# Altium schematic sheet Current Regulator.SchDoc
size Letter
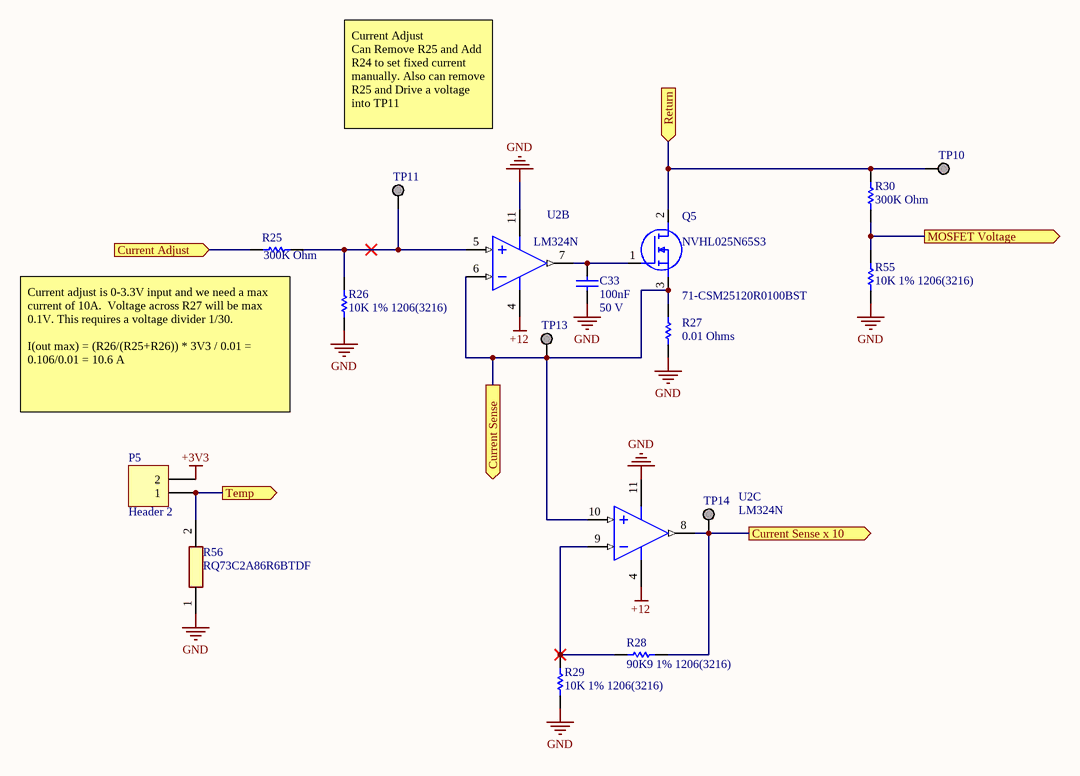
[diagram p0: Current Regulator.SchDoc]

## Parts
C33  value 100nF  Rated Voltage: 50 V  [CAPC1206(3216)100_N]  (hidden comment: CAP 100nF 50V 1206(3216))
P5  Header 2  [HDR1X2]
Q5  NVHL025N65S3  [TO556P482X1562X2475-3P]
R25  value 300K Ohm  [RESC1206(3216)_L]  (hidden comment: 300K 1% 1206(3216))
R26  10K 1% 1206(3216)  [RESC1206(3216)_L]
R27  value 0.01 Ohms  Supplier Part Number 1: 71-CSM25120R0100BST  [RESC2512(6432)_L]  (hidden comment: 0.01Ohms 1% 2512(6432))
R28  90K9 1% 1206(3216)  [RESC1206(3216)_L]
R29  10K 1% 1206(3216)  [RESC1206(3216)_L]
R30  value 300K Ohm  [RESC1206(3216)_L]  (hidden comment: 300K 1% 1206(3216))
R55  10K 1% 1206(3216)  [RESC1206(3216)_L]
R56  RQ73C2A86R6BTDF  [RESC2012X65N]
TP10  Return  [KSTN-1502-2]  (value not drawn)
TP11  Current Adjust  [KSTN-1502-2]  (value not drawn)
TP13  CS  [KSTN-1502-2]  (value not drawn)
TP14  CS 10x  [KSTN-1502-2]  (value not drawn)
U2  LM324N  [N14A]  (parts B,C of 4)

## Ports
Current Adjust (in), Current Sense (out), Current Sense x 10 (out), MOSFET Voltage (out), Return (in), Temp (out)

## Nets
+3V3: P5.2
+12: U2.4(V+)
GND: C33.2 R26.1 R27.1 R29.1 R55.1 R56.1 U2.11(GND)
Current Adjust: R25.1 ; port Current Adjust
Current Sense: Q5.3(S) R27.2 TP13.1 U2.6(IN2-) U2.10(IN3+) ; port Current Sense
Current Sense x 10: R28.2 TP14.1 U2.8(OUT3) ; port Current Sense x 10
MOSFET Voltage: R30.1 R55.2 ; port MOSFET Voltage
Return: Q5.2(D) R30.2 TP10.1 ; port Return
Temp: P5.1 R56.2 ; port Temp
NetC33_1: C33.1 Q5.1(G) U2.7(OUT2)
NetR25_2: R25.2 R26.2 TP11.1 U2.5(IN2+)
NetR28_1: R28.1 R29.2 U2.9(IN3-)

## Notes on the sheet
- Current Adjust
  Can Remove R25 and Add R24 to set fixed current manually. Also can remove R25 and Drive a voltage into TP11
- (near R25) Current adjust is 0-3.3V input and we need a max current of 10A.  Voltage across R27 will be max 0.1V. This requires a voltage divider 1/30.
  I(out max) = (R26/(R25+R26)) * 3V3 / 0.01 = 0.106/0.01 = 10.6 A

## Library data of the parts
C33 = CMP-1037-04202-1: CAP 100nF 50V ±10% 1206 (3216 Metric) Thickness 1mm SMD; Case-Metric: 3216; Tolerance: Â±10%; Case-EIA: 1206; Technology: SMT; Max Thickness: 1 mm
P5 = Header 2: Header, 2-Pin; LatestRevisionDate: 17-Jul-2002; LatestRevisionNote: Re-released for DXP Platform.; Publisher: Altium Limited
Q5 = NVHL025N65S3: MOSFET (N-Channel); Manufacturer_Name: ON Semiconductor; Datasheet Link: https://www.onsemi.com/pub/Collateral/NVHL025N65S3-D.PDF; Height: 4.82mm; Manufacturer_Part_Number: NVHL025N65S3; Mouser Part Number: 863-NVHL025N65S3; Mouser Price/Stock: https://www.mouser.com/Search/Refine.aspx?Keyword=863-NVHL025N65S3
R25 R30 = CMP-1014-00788-1: 300K 0.25W 1% 1206 (3216 Metric)  SMD; Case-EIA: 1206; Case-Metric: 3216; Technology: SMT; Tolerance: 1 %; Power: 0.25 W
R26 R55 = CMP-1014-00623-1: 10K 0.25W 1% 1206 (3216 Metric)  SMD; Case-Metric: 3216; Value: 10000.00 Ohm; Case-EIA: 1206; Populate: 0; Power: 0.25 W; Technology: SMT; Tolerance: 1 %
R27 = CMP-1018-00510-1: Case-EIA: 2512; Case-Metric: 6432; Power: 1 W; Technology: SMT; Tolerance: 1 %; Supplier 1: Mouser
R28 = CMP-1014-00731-1: 90K9 0.25W 1% 1206 (3216 Metric)  SMD; Case-Metric: 3216; Case-EIA: 1206; Value: 90900.00 Ohm; Tolerance: 1 %; Power: 0.25 W; Technology: SMT
R29 = CMP-1014-00623-1: 10K 0.25W 1% 1206 (3216 Metric)  SMD; Case-Metric: 3216; Value: 10000.00 Ohm; Case-EIA: 1206; Power: 0.25 W; Technology: SMT; Tolerance: 1 %
R56 = RQ73C2A86R6BTDF: Resistor; Manufacturer_Name: TE Connectivity; Datasheet Link: https://componentsearchengine.com/Datasheets/1/RQ73C2A86R6BTDF.pdf; Height: 0.65mm; Manufacturer_Part_Number: RQ73C2A86R6BTDF; Arrow Part Number: RQ73C2A86R6BTDF; Mouser Part Number: 279-RQ73C2A86R6BTDF; Mouser Price/Stock: https://www.mouser.com/Search/Refine.aspx?Keyword=279-RQ73C2A86R6BTDF
TP10 = CMP-1672-00001-4: Contact Finish: Tin; Lead Pitch: 0.218 inch; PackageReference: 1502-2; Mount: Through Hole; Pins: 50; DatasheetVersion: Rev. A, 02/2008; RoHSCompliant: true; REACH SVHC: No SVHC; Contact Material: Brass; Length: 2.77 mm; PackageDescription: 1-Pin Through Hole Device, Dia 3.18 mm; Package Quantity: 1; Mounting Technology: Through Hole; Supplier 1: Mouser; Supplier Part Number 1: 575-2501200800000
TP11 TP13 TP14 = CMP-1672-00001-4: Terminal DBL Turret, Through Hole, RoHS; Contact Finish: Tin; Lead Pitch: 0.218 inch; PackageReference: 1502-2; Mount: Through Hole; Pins: 50; DatasheetVersion: Rev. A, 02/2008; RoHSCompliant: true; REACH SVHC: No SVHC; Contact Material: Brass; Length: 2.77 mm; PackageDescription: 1-Pin Through Hole Device, Dia 3.18 mm; Package Quantity: 1; Mounting Technology: Through Hole; Supplier 1: Mouser; Supplier Part Number 1: 575-2501200800000
U2 = CMP-0055-00082-1: Low Power Quad Operational Amplifier, 14-pin MDIP; Manufacturer: National Semiconductor; PackageTopMarking: NSUZXYYTTE#*LM324N; PowerWise: N; CompType: Amplifiers; PinCount: 14; PackageVersion: revG, May-2006; PackageReference: N14A; Code_JEDEC: MS-001-AA; PackageDescription: MDIP, .750 x .250 x.130in, 14 Lead, .100in Pitch; RoHS: N; DatasheetVersion: Aug-2000